# EAGLE design amp-LNA-BGB741L7ESD (EAGLE 9.5.1)
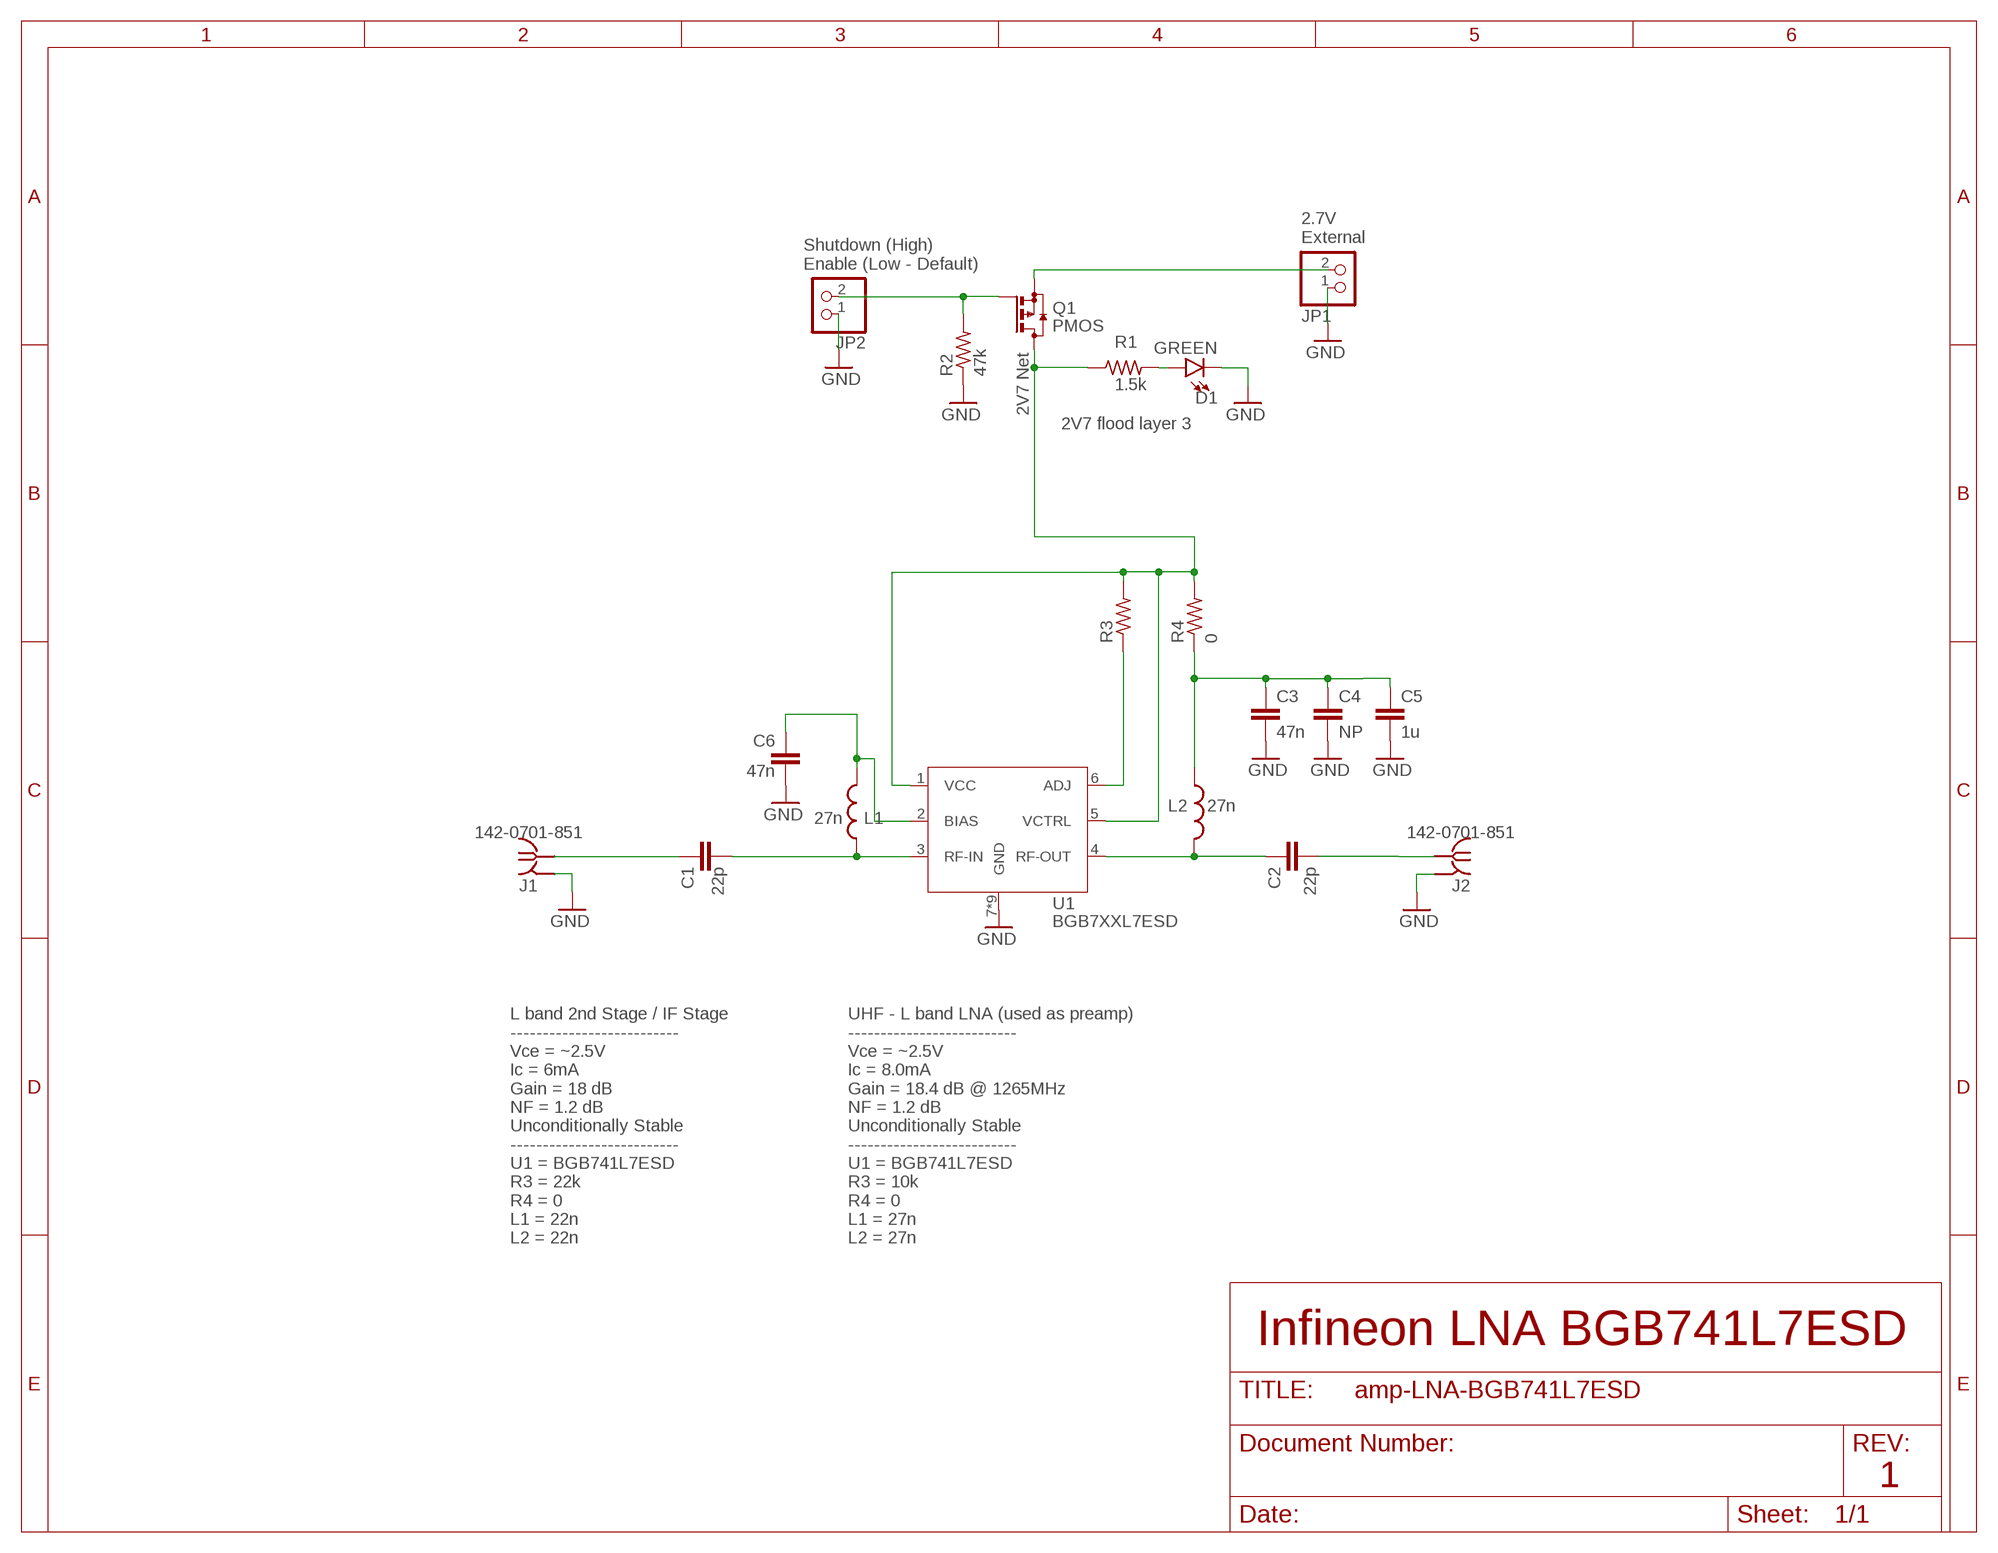
[diagram p0: schematic, sheet 1]

## Parts
C1  22p  C-EU0402-C-NOSILK  [.0402-C-NOSILK]
C2  22p  C-EU0402-C-NOSILK  [.0402-C-NOSILK]
C3  47n  C-EU0603-B-NOSILK  [.0603-B-NOSILK]
C4  NP  C-EU0603-B-NOSILK  [.0603-B-NOSILK]
C5  1u  C-EU0603-B-NOSILK  [.0603-B-NOSILK]
C6  47n  C-EU0603-B-NOSILK  [.0603-B-NOSILK]
D1  GREEN  LED-GREEN0603  [LED-0603]
J1  142-0701-851  [142-0701-851]
J2  142-0701-851  [142-0701-851]
JP1  PINHD-1X2  [1X02]
JP2  PINHD-1X2  [1X02]
L1  27n  L-US0603-C-NOSILK  [.0603-C-NOSILK]
L2  27n  L-US0603-C-NOSILK  [.0603-C-NOSILK]
Q1  PMOS  BSS84  [SOT23]
R1  1.5k  R-US_0603-B-NOSILK  [.0603-B-NOSILK]
R2  47k  R-US_0402-B-NOSILK  [.0402-B-NOSILK]
R3  27k / NP  R-US_0603-B-NOSILK  [.0603-B-NOSILK]
R4  0  R-US_0603-B-NOSILK  [.0603-B-NOSILK]
U1  BGB7XXL7ESD  [BGB7XXL7ESD]

## Nets
2V7: Q1.3(D) R1.1 R3.2 R4.2 U1.1(VCC) U1.5(VCTRL)
GND: C3.2 C4.2 C5.2 C6.2 D1.C J1.GND1(GND) J1.GND2(GND) J1.GND3(GND) J1.GND4(GND) J2.GND1(GND) J2.GND2(GND) J2.GND3(GND) J2.GND4(GND) JP1.1 JP2.1 R2.1 U1.7(GND) U1.8(GND) U1.9(GND) U1.10(GND) U1.11(GND) U1.12(GND) U1.13(GND) U1.14(GND) U1.15(GND)
N$1: JP2.2 Q1.1(G) R2.2
N$2: C3.1 C4.1 C5.1 L2.1 R4.1
N$4 [RF1]: C2.1 L2.2 U1.4(RF-OUT)
N$5: R3.1 U1.6(ADJ)
N$7: C6.1 L1.2 U1.2(BIAS)
N$10: D1.A R1.2
N$11 [RF1]: C1.2 L1.1 U1.3(RF-IN)
RF-IN [RF2]: C1.1 J1.RF1(RF)
RF_OUT [RF2]: C2.2 J2.RF1(RF)
VEXT: JP1.2 Q1.2(S)

## Notes on the sheet
- 2.7V
  External
- Shutdown (High)
  Enable (Low - Default)
- 2V7 Net
- 2V7 flood layer 3
- L band 2nd Stage / IF Stage
  --------------------------
  Vce = ~2.5V
  Ic = 6mA
  Gain = 18 dB
  NF = 1.2 dB
  Unconditionally Stable
  --------------------------
  U1 = BGB741L7ESD
  R3 = 22k
  R4 = 0
  L1 = 22n
  L2 = 22n
- UHF - L band LNA (used as preamp)
  --------------------------
  Vce = ~2.5V
  Ic = 8.0mA
  Gain = 18.4 dB @ 1265MHz
  NF = 1.2 dB
  Unconditionally Stable
  --------------------------
  U1 = BGB741L7ESD
  R3 = 10k
  R4 = 0
  L1 = 27n
  L2 = 27n
- Infineon LNA BGB741L7ESD
- 1

## Library data of the parts
C1-C6 = oresat-rcl:C-EU: CAPACITOR, European symbol
D1 = SparkFun-LED:LED-GREEN: Green SMD LED Used in manufacturing of various products at SparkFun Packages: 0603 - SMD 0603 package [Product Link] <http://www.futureelectronics.com/en/technologies/semiconductors/optoelectronics/leds/Pages/9894312-LTST-C190GKT.aspx?CrossPart=HSMG-C190&IM=0> LilyPad 1206 - SMD1206 LilyPad package [Product Link] <http://www.futureelectronics.com/en/Technologies/Product.aspx?ProductID=IN150NGHARVATEKCORPORATION2049943&IM=0> 1206 - SMD1206 package [Product Link] <http://www.futureelectronics.com/en/technologies/semiconductors/optoelectronics/leds/Pages/8315665-LTST-C150KGKT.aspx?IM=0> 1206 Bottom Mount -SMD 1206 Bottom Mount [Product Link] <http://www.digikey.com/product-detail/en/lite-on-inc/LTST-C230KGKT/160-1456-1-ND/386854> SparkFun Products: Pro Mini 328 -5V <https://www.sparkfun.com/products/821> RedBoard <https://www.sparkfun.com/products/12757> MP3 Trigger <https://www.sparkfun.com/products/13720> Makey Makey <https://www.sparkfun.com/products/11076>
J1 J2 = J-Cinch-142-0701-851-SMA-end-launch:142-0701-851: SMA Jack 50Ω - End Launch Source: Datasheet <https://belfuse.com/resources/productinformations/cinchconnectivitysolutions/johnson/pi-ccs-john-142-0701-851.pdf>
JP1 JP2 = pinhead:PINHD-1X2: PIN HEADER
L1 L2 = oresat-rcl:L-US: INDUCTOR, American symbol
Q1 = transistor-small-signal:BSS84: P-CHANNEL MOS FET
R1-R4 = oresat-rcl:R-US_: RESISTOR, American symbol
U1 = U-Infineon-BGB7xxL7ESD-LNA:BGB7XXL7ESD: High Performance LNAs BGB707L7ESD 0.05 - 10 GHz Operational Bandwidth NFmin = 0.60 dB at 2.4 GHz Source: Datasheet <https://www.infineon.com/cms/en/product/rf-wireless-control/low-noise-amplifier-lna-ics/general-purpose-lnas/bgb707l7esd/> BGB741L7ESD 0.03 - 5 GHz Operational Bandwidth NFmin = 1.05 dB at 2.4 GHz Source: Datasheet <https://www.infineon.com/cms/en/product/rf-wireless-control/low-noise-amplifier-lna-ics/general-purpose-lnas/bgb741l7esd/>

## Net classes
1 RF1: clearance 0.5 mm
2 RF2: clearance 0.8 mm

## Board
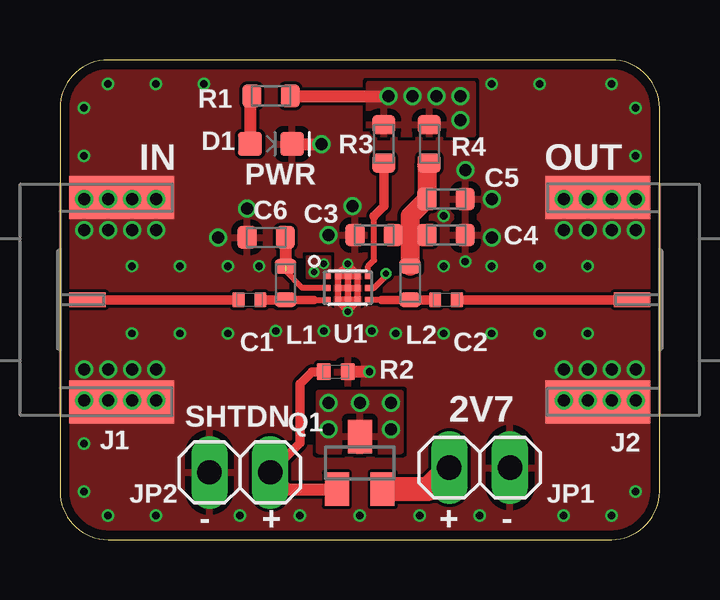
[diagram p1: board, top side]
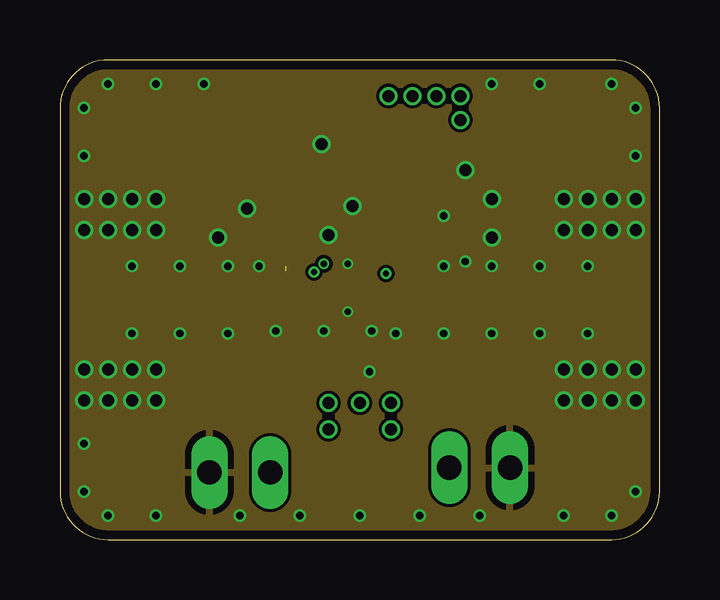
[diagram p2: board, inner layer Route2]
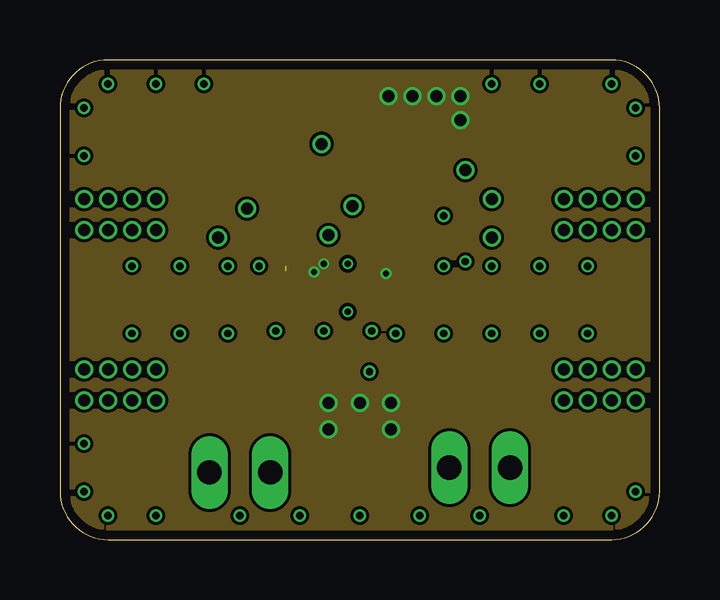
[diagram p3: board, inner layer Route15]
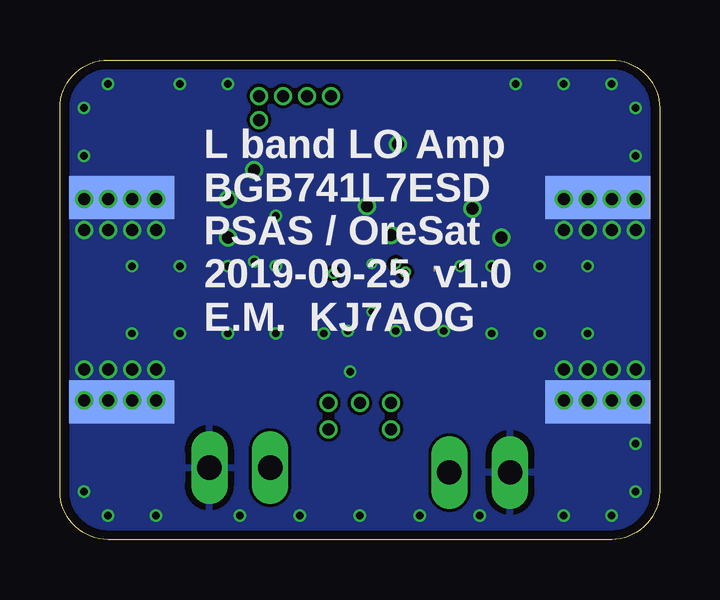
[diagram p4: board, bottom side, seen from below]

Size 25 x 20 mm. Coordinates in mm from the lower left corner, seen from the top.
Outline: 25,2 25,18 arc90 23,20 2,20 arc90 0,18 0,2 arc90 2,0 23,0 arc90 25,2
Copper layers (1*2*15*16): Top 0.035559375mm / dielectric 0.17018125mm / Route2 0.01778125mm / dielectric 47mil / Route15 0.01778125mm / dielectric 0.17018125mm / Bottom 0.035559375mm
Design rules "oshpark-4layer-tented": minimum track width 5mil, minimum drill 10mil, track to track 5mil, track to pad 5mil, pad to pad 5mil, via to via 5mil, smd to smd 5mil, copper to edge 15mil, drill to drill 6mil, minimum pad ring 4mil, minimum via ring 4mil, stop-mask expansion 2.5mil, vias tented up to drill 20mil, thermal gap 10mil

### Footprints (pad centres in the part's own frame; a part is rotated, then mirrored left to right if it is on the bottom)
.0402-C-NOSILK = smd 0.5 x 0.6: 1 -0.45,0; 2 0.45,0
.0603-B-NOSILK = smd 0.8 x 0.95: 1 -0.8,0; 2 0.8,0
LED-0603 = smd 1 x 1: A -0.877,0; C 0.877,0
142-0701-851 = smd 1.8 x 4.37: GND1 -4.255,-2.566; GND2 4.255,-2.566 | smd 1.8 x 4.37 bottom: GND3 -4.255,-2.566; GND4 4.255,-2.566 | smd 0.6 x 1.53: RF1 0,-1.146
1X02 = drill 1.016 long: 1 -1.27,0; 2 1.27,0
.0603-C-NOSILK = smd 0.6 x 0.9: 1 -0.7,0; 2 0.7,0
SOT23 = smd 1 x 1.4: 1 -0.95,-1.1; 2 0.95,-1.1; 3 0,1.1
.0402-B-NOSILK = smd 0.6 x 0.7: 1 -0.5,0; 2 0.5,0
BGB7XXL7ESD = smd 0.25 x 0.25: 1 -0.5,-0.85; 2 0,-0.85; 3 0.5,-0.85; 4 0.5,0.85; 5 0,0.85; 6 -0.5,0.85; 7 0.48,-0.4; 8 0,-0.4; 9 -0.48,-0.4; 10 0.48,0; 11 0,0; 12 -0.48,0; 13 0.48,0.4; 14 0,0.4; 15 -0.48,0.4

### Placement (x,y rotation side)
C1  7.9,10 0 top
C2  16.1,10 0 top
C3  13.1,12.7 180 top
C4  16.1,12.7 0 top
C5  16.1,14.2 0 top
C6  8.6,12.6 180 top
D1  8.8,16.5 0 top
J1  0,10 90 top
J2  25,10 270 top
JP1  17.5,3 180 top
JP2  7.5,2.8 0 top
L1  9.4,10.7 90 top
L2  14.6,10.7 270 top
Q1  12.5,3.2 0 top
R1  8.8,18.5 180 top
R2  11.5,7 180 top
R3  13.5,16.5 90 top
R4  15.4,16.5 90 top
U1  12,10.5 270 top

### Tracks (layer width: path | path; a pad name or v marks a point on that pad's centre or on a via)
2V7  (via drill 0.25, 0.5)
  Top 0.25: U1.5 13.1,10.5 13.6,11 v13.6,11.1
  Top 0.5: R1.1 v13.7,18.5
  other vias: 12.5,5.7 13.8,5.7 13.8,4.6 11.2,4.6 11.2,5.7 16.7,17.5 16.7,18.5 14.7,18.5 15.7,18.5 11,11.5 10.6,11.15
  pour Route15: 0,20 0,0 25,0 25,20
  pour Top: 10.8,6.1 10.8,3.7 14.2,3.7 14.2,6.1
  pour Top: 17.2,16.9 12.9,16.9 12.9,19 17.2,19
  pour Top (no thermals): 11.25,10.9 11.25,11.8 10.3,11.8 10.3,10.9
GND  (via drill 0.25, 0.3, 0.5)
  Top 0.25: U1.9 11.6,11.1 v12,11.5 | U1.15 12.4,11.1 v12,11.5 | U1.12 v12,11.5 | U1.7 11.6,9.9 v12,9.5 12.4,9.9 U1.13 | U1.8 U1.7 | U1.9 U1.8 | U1.12 U1.11 | U1.15 U1.14 | U1.14 U1.13 | U1.10 U1.7 | U1.10 U1.13 | U1.11 U1.8 | U1.11 U1.14 | U1.12 U1.15 | U1.12 U1.9 | U1.11 U1.10
  Top 0.5: 9.7,16.48 D1.C 10.8,16.5 | v12.9,7 R2.1
  other vias: 21,5.8 22,5.8 23,5.8 24,5.8 24,7.1 23,7.1 22,7.1 21,7.1 21,12.9 22,12.9 23,12.9 24,12.9 24,14.2 23,14.2 22,14.2 21,14.2 1,14.2 2,14.2 3,14.2 4,14.2 1,12.9 2,12.9 3,12.9 4,12.9 1,5.8 2,5.8 3,5.8 4,5.8 1,7.1 2,7.1 3,7.1 4,7.1 3,8.6 5,8.6 7,8.6 9,8.7 11,8.7 22,8.6 20,8.6 18,8.6 16,8.6 14,8.6 13,8.7 3,11.4 5,11.4 7,11.4 8.3,11.4 6.6,12.6 7.8,13.8 10.9,16.5 11.2,12.7 12.2,13.9 18,12.6 18,14.2 22,11.4 20,11.4 18,11.4 16,11.4 16.9,11.6 16,13.5 16.9,15.4 1,2 1,4 2,1 4,1 23,1 24,2 21,1 17.5,1 7.5,1 10,1 12.5,1 15,1 24,18 24,16 23,19 20,19 18,19 1,18 2,19 4,19 6,19 1,16
  pour Top (rank 2): 0,20 0,0 25,0 25,20
  pour Bottom: 0,20 0,0 25,0 25,20
  pour Route2: 0,20 0,0 25,0 25,20
  pour Top (no thermals): 0,16 5,16 5,4 0,4
  pour Top (no thermals): 20,16 25,16 25,4 20,4
  pour Bottom (no thermals): 0,16 5,16 5,4 0,4
  pour Bottom (no thermals): 20,16 25,16 25,4 20,4
N$1
  Top 0.4: R2.2 10.5,7 10,6.5 10,4.03 JP2.2
  Top 0.5: Q1.1 9.47,2.1 JP2.2 8.8,2.83
N$2
  Top 0.5: C4.1 14.6,12.7 C3.1
  Top 0.8: R4.1 15.3,15.6 C5.1 14.6,13.5 14.6,12.7 L2.1
N$4
  Top 0.25: 13.4,10 U1.4
  Top 0.35: L2.2 13.4,10
  Top 0.39: L2.2 C2.1
N$5
  Top 0.25: U1.6 12.85,11.4 13.1,11.65 13.1,13.5
  Top 0.4: 13.1,13.5 13.5,13.9 R3.1
N$7  (1 unrouted)
  Top 0.25: U1.2 10.1,10.5 9.4,11.2
  Top 0.5: C6.1 L1.2
N$10
  Top 0.5: R1.2 7.92,18.42 D1.A
N$11
  Top 0.25: 10.6,10 U1.3
  Top 0.35: L1.1 10.6,10
  Top 0.39: L1.1 C1.2
RF-IN
  Top 0.39: C1.1 J1.RF1
RF_OUT
  Top 0.39: C2.2 J2.RF1
VEXT
  Top 1: JP1.2 15.33,2.1 Q1.2

### Text on the board
tPlace: IN | PWR | OUT | SHTDN | 2V7 | - | + | + | -
bPlace: L band LO Amp / BGB741L7ESD / PSAS / OreSat / 2019-09-25 v1.0 / E.M. KJ7AOG